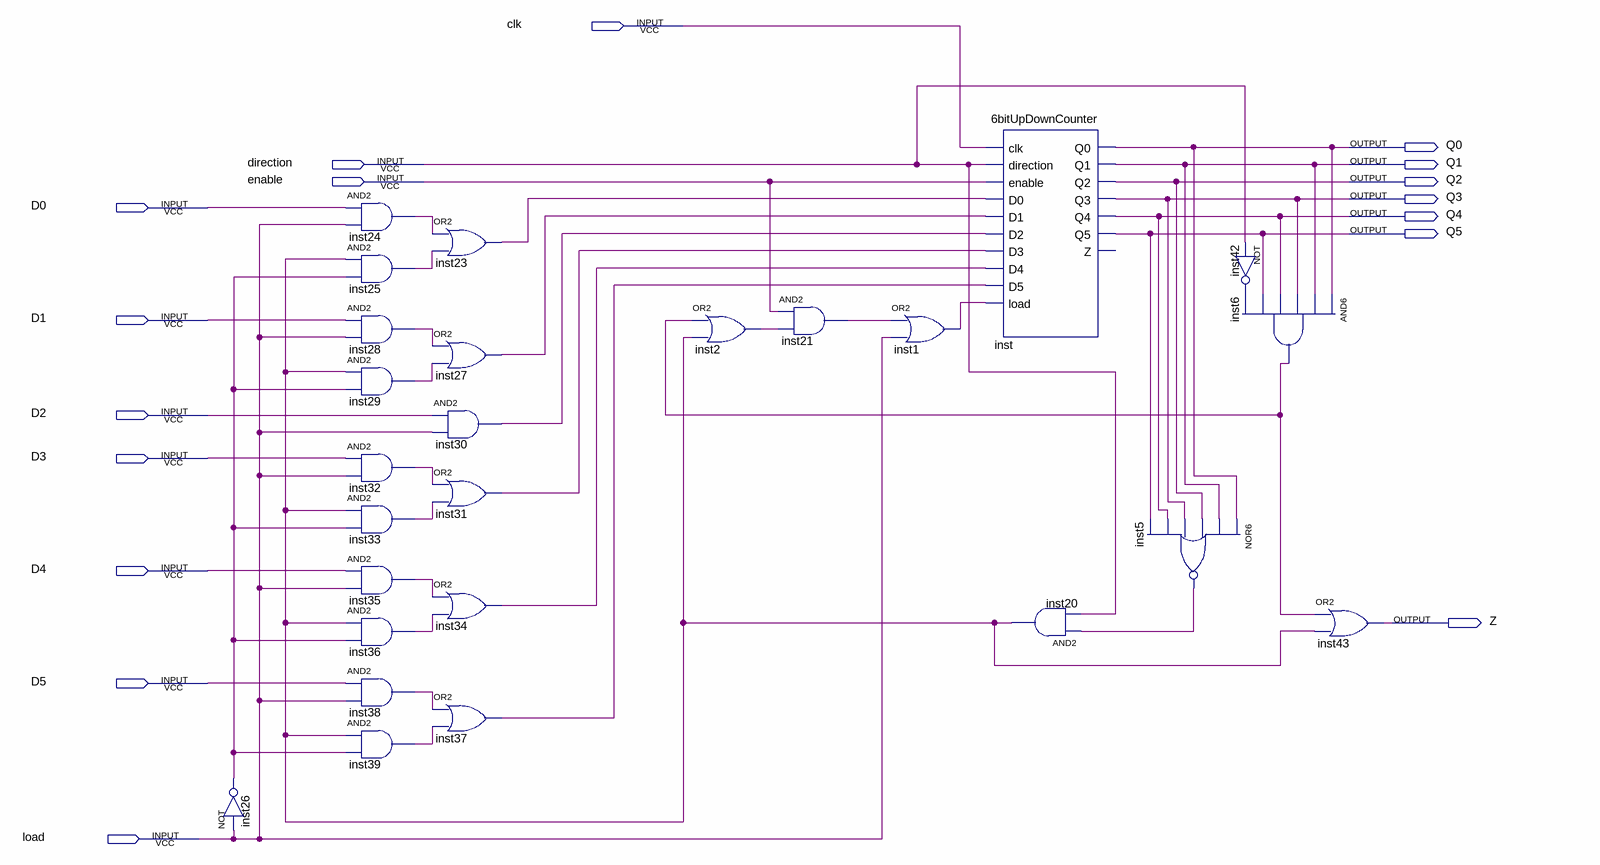
[diagram p0: schematic sheet]
// Quartus schematic counterMn.bdf as structural Verilog: 26 symbols, 17 pins
module counterMn (
  input  clk,
  input  direction,
  input  enable,
  input  D0,
  input  D1,
  input  D2,
  input  D3,
  input  D4,
  input  D5,
  input  load,
  output Q0,
  output Q1,
  output Q2,
  output Q3,
  output Q4,
  output Q5,
  output Z
);

  wire inst1_out, inst2_out, inst5_out, inst6_out, inst20_out, inst21_out, inst23_out, inst24_out,
       inst25_out, inst26_out, inst27_out, inst28_out, inst29_out, inst30_out, inst31_out, inst32_out,
       inst33_out, inst34_out, inst35_out, inst36_out, inst37_out, inst38_out, inst39_out, inst42_out;

  not inst26 (inst26_out, load);
  and inst24 (inst24_out, D0, load);
  and inst25 (inst25_out, inst20_out, inst26_out);
  and inst28 (inst28_out, D1, load);
  and inst29 (inst29_out, inst20_out, inst26_out);
  and inst32 (inst32_out, D3, load);
  and inst33 (inst33_out, inst20_out, inst26_out);
  and inst35 (inst35_out, D4, load);
  and inst36 (inst36_out, inst20_out, inst26_out);
  and inst38 (inst38_out, D5, load);
  and inst39 (inst39_out, inst20_out, inst26_out);
  or inst23 (inst23_out, inst24_out, inst25_out);
  or inst27 (inst27_out, inst28_out, inst29_out);
  and inst30 (inst30_out, D2, load);
  or inst31 (inst31_out, inst32_out, inst33_out);
  or inst34 (inst34_out, inst35_out, inst36_out);
  or inst37 (inst37_out, inst38_out, inst39_out);
  or inst2 (inst2_out, inst6_out, inst20_out);
  and inst21 (inst21_out, enable, inst2_out);
  or inst1 (inst1_out, inst21_out, load);
  \6bitUpDownCounter  inst (
    .clk(clk), .direction(direction), .enable(enable), .D0(inst23_out), .D1(inst27_out), .D2(inst30_out),
    .D3(inst31_out), .D4(inst34_out), .D5(inst37_out), .load(inst1_out), .Q0(Q0), .Q1(Q1), .Q2(Q2), .Q3(Q3),
    .Q4(Q4), .Q5(Q5));  // open: Z
  and inst20 (inst20_out, inst5_out, direction);
  nor inst5 (inst5_out, Q0, Q1, Q2, Q3, Q4, Q5);
  not inst42 (inst42_out, direction);
  and inst6 (inst6_out, Q0, Q1, Q3, Q4, Q5, inst42_out);
  or inst43 (Z, inst6_out, inst20_out);
endmodule
